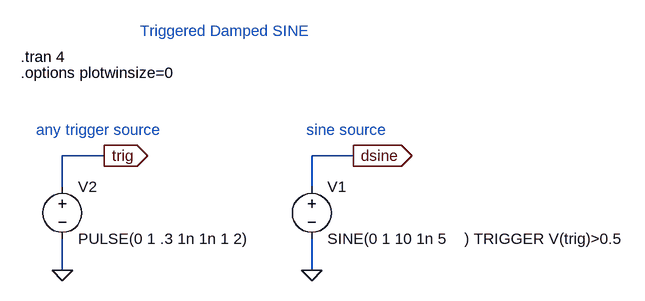
[diagram p0: schematic trigger_sine_damped.asc]
trigger_sine_damped.asc, the LTspice schematic file:
Version 4
SHEET 1 1312 680
WIRE -112 144 -176 144
WIRE 272 144 208 144
WIRE -176 192 -176 144
WIRE 208 192 208 144
WIRE -176 320 -176 272
WIRE 208 320 208 272
FLAG -176 320 0
FLAG -112 144 trig
IOPIN -112 144 Out
FLAG 208 320 0
FLAG 272 144 dsine
IOPIN 272 144 Out
SYMBOL voltage -176 176 R0
WINDOW 123 0 0 Left 0
WINDOW 39 0 0 Left 0
SYMATTR InstName V2
SYMATTR Value PULSE(0 1 .3 1n 1n 1 2)
SYMBOL voltage 208 176 R0
WINDOW 123 0 0 Left 0
WINDOW 39 0 0 Left 0
SYMATTR InstName V1
SYMATTR Value SINE(0 1 10 1n 5    ) TRIGGER V(trig)>0.5
TEXT -240 -8 Left 0 !.tran 4
TEXT -56 -48 Left 0 ;Triggered Damped SINE
TEXT -240 16 Left 0 !.options plotwinsize=0
TEXT -216 104 Left 0 ;any trigger source
TEXT 200 104 Left 0 ;sine source

The netlist it stands for:
* trigger_sine_damped.asc
V2 trig 0 PULSE(0 1 .3 1n 1n 1 2)
V1 dsine 0 SINE(0 1 10 1n 5    ) TRIGGER V(trig)>0.5
.tran 4
* Triggered Damped SINE
.options plotwinsize=0
* any trigger source
* sine source
.backanno
.end